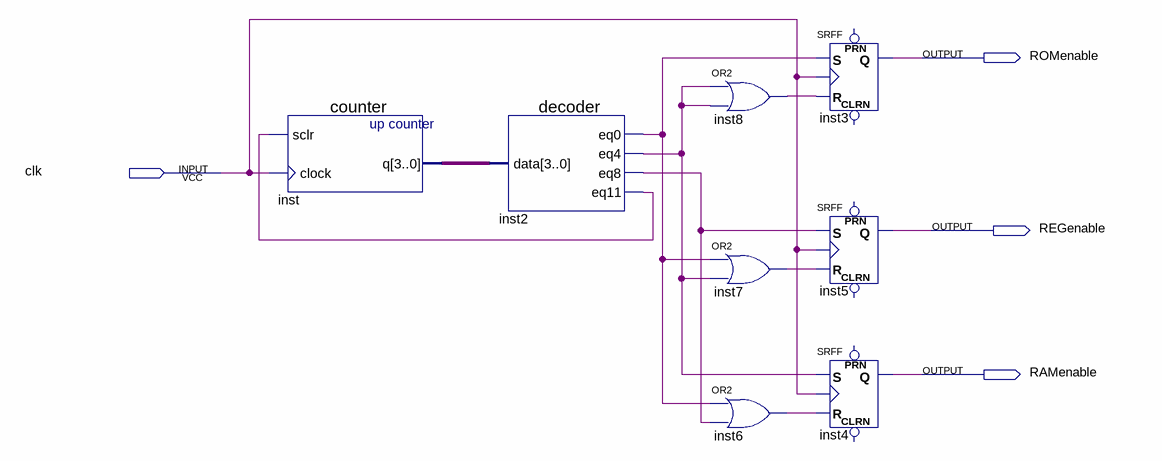
[diagram p0: schematic sheet]
// Quartus schematic ControlUnit.bdf as structural Verilog: 8 symbols, 4 pins
module ControlUnit (
  input  clk,
  output ROMenable,
  output REGenable,
  output RAMenable
);

  wire inst2_eq0, inst2_eq4, inst2_eq8, inst2_eq11, inst6_out, inst7_out, inst8_out;
  wire [3:0] inst_q;

  counter inst (.sclr(inst2_eq11), .clock(clk), .q(inst_q));
  decoder inst2 (.data(inst_q), .eq0(inst2_eq0), .eq4(inst2_eq4), .eq8(inst2_eq8), .eq11(inst2_eq11));
  or inst8 (inst8_out, inst2_eq4, inst2_eq4);
  or inst7 (inst7_out, inst2_eq0, inst2_eq4);
  or inst6 (inst6_out, inst2_eq0, inst2_eq8);
  SRFF inst3 (.S(inst2_eq0), .R(inst8_out), .CLK(clk), .Q(ROMenable));  // open: PRN, CLRN
  SRFF inst5 (.S(inst2_eq8), .R(inst7_out), .CLK(clk), .Q(REGenable));  // open: PRN, CLRN
  SRFF inst4 (.S(inst2_eq4), .R(inst6_out), .CLK(clk), .Q(RAMenable));  // open: PRN, CLRN
endmodule
